# EAGLE design AZ1A_PCB_001 (EAGLE 8.7.0)
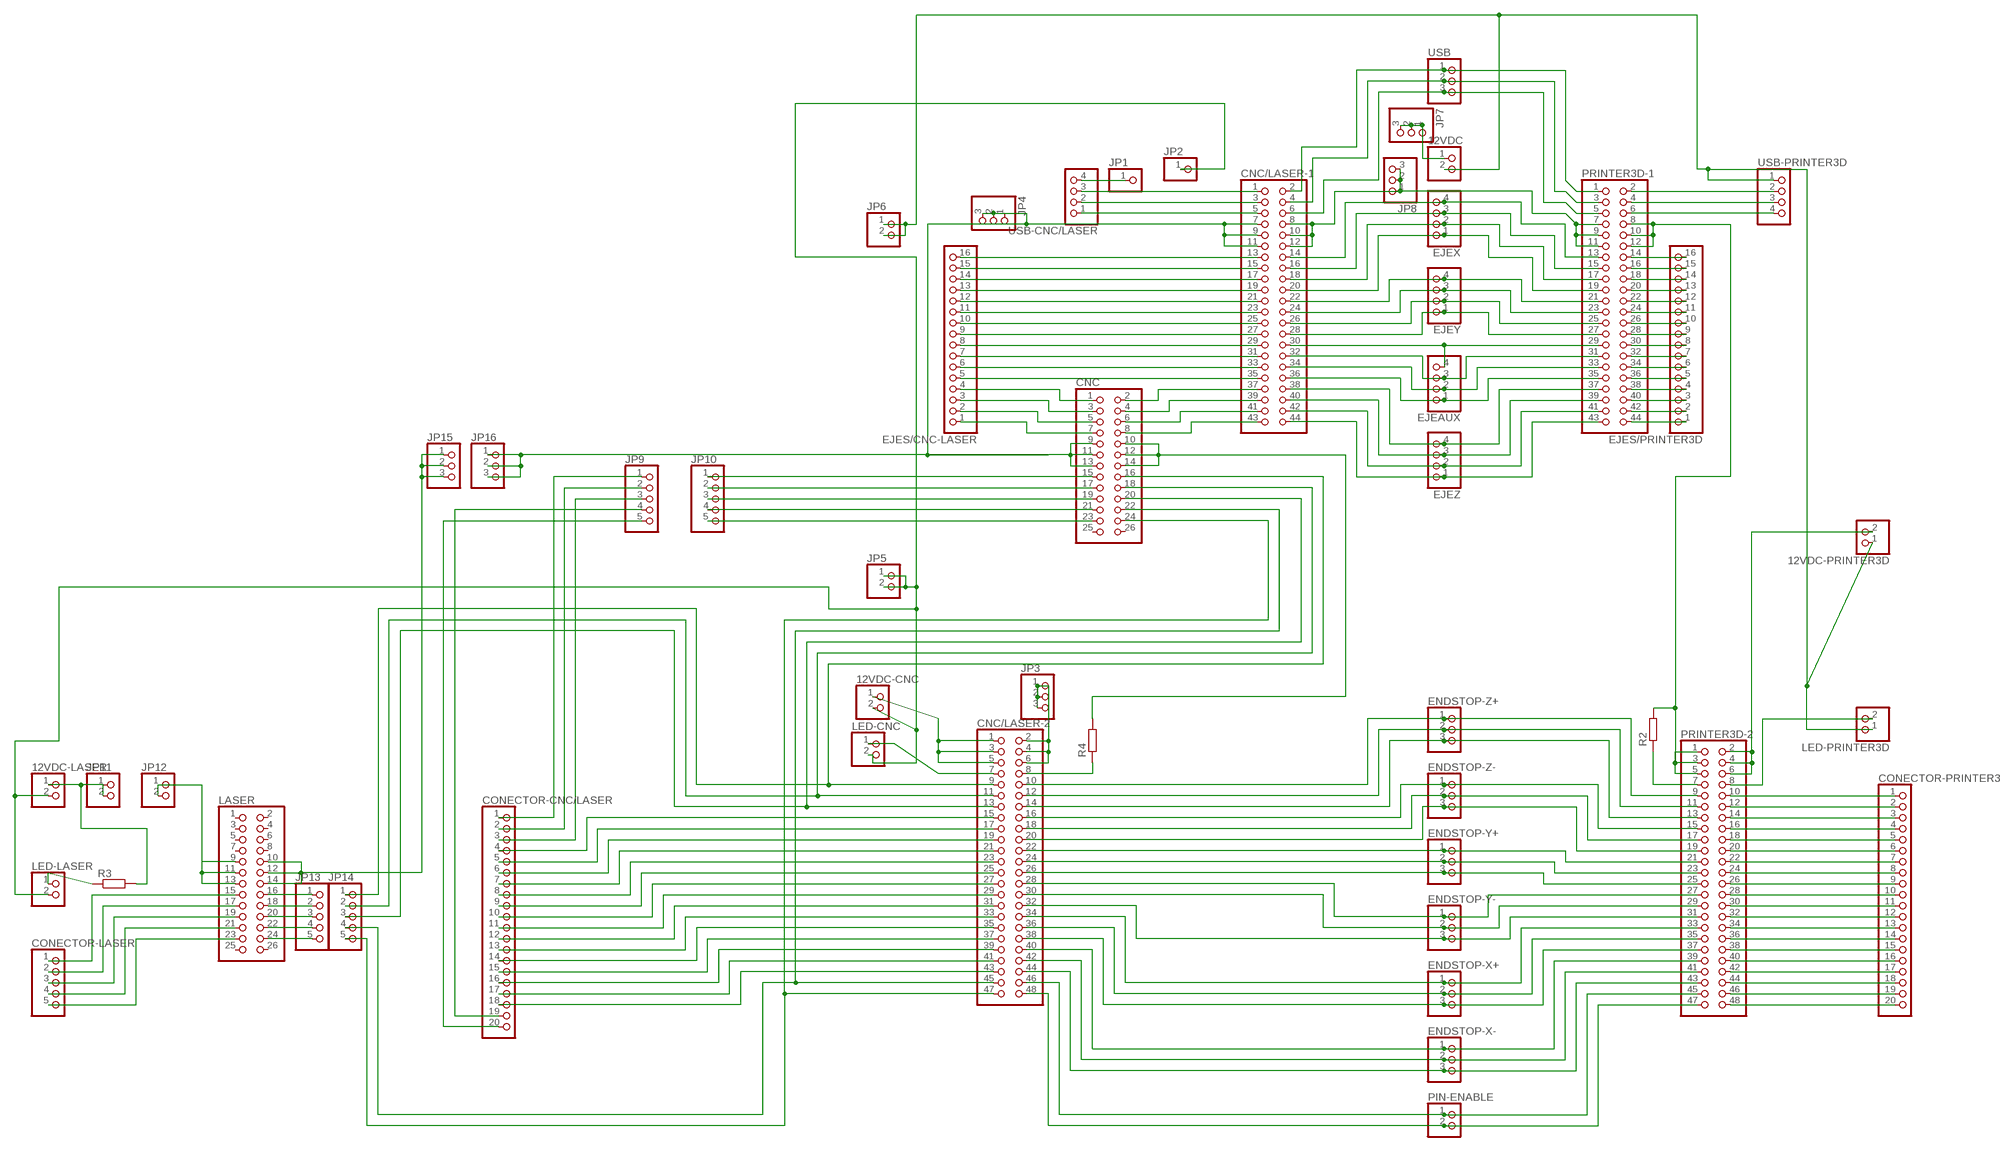
[diagram p0: schematic, sheet 1]

## Parts
12VDC  PINHD-1X2  [1X02]
12VDC-CNC  PINHD-1X2  [1X02]
12VDC-LASER  PINHD-1X2  [1X02]
12VDC-PRINTER3D  PINHD-1X2  [1X02]
CNC  PINHD-2X13  [2X13]
CNC/LASER-1  PINHD-2X22  [2X22]
CNC/LASER-2  PINHD-2X24  [2X24]
CONECTOR-CNC/LASER  PINHD-1X20  [1X20]
CONECTOR-LASER  PINHD-1X5  [1X05]
CONECTOR-PRINTER3D  PINHD-1X20  [1X20]
EJEAUX  PINHD-1X4  [1X04]
EJES/CNC-LASER  PINHD-1X16  [1X16]
EJES/PRINTER3D  PINHD-1X16  [1X16]
EJEX  PINHD-1X4  [1X04]
EJEY  PINHD-1X4  [1X04]
EJEZ  PINHD-1X4  [1X04]
ENDSTOP-X+  PINHD-1X3  [1X03]
ENDSTOP-X-  PINHD-1X3  [1X03]
ENDSTOP-Y+  PINHD-1X3  [1X03]
ENDSTOP-Y-  PINHD-1X3  [1X03]
ENDSTOP-Z+  PINHD-1X3  [1X03]
ENDSTOP-Z-  PINHD-1X3  [1X03]
JP1  PINHD-1X1  [1X01]
JP2  PINHD-1X1  [1X01]
JP3  PINHD-1X3  [1X03]
JP4  PINHD-1X3  [1X03]
JP5  PINHD-1X2  [1X02]
JP6  PINHD-1X2  [1X02]
JP7  PINHD-1X3  [1X03]
JP8  PINHD-1X3  [1X03]
JP9  PINHD-1X5  [1X05]
JP10  PINHD-1X5  [1X05]
JP11  PINHD-1X2  [1X02]
JP12  PINHD-1X2  [1X02]
JP13  PINHD-1X5  [1X05]
JP14  PINHD-1X5  [1X05]
JP15  PINHD-1X3  [1X03]
JP16  PINHD-1X3  [1X03]
LASER  PINHD-2X13  [2X13]
LED-CNC  PINHD-1X2  [1X02]
LED-LASER  PINHD-1X2  [1X02]
LED-PRINTER3D  PINHD-1X2  [1X02]
PIN-ENABLE  PINHD-1X2  [1X02]
PRINTER3D-1  PINHD-2X22  [2X22]
PRINTER3D-2  PINHD-2X24  [2X24]
R2  R-EU_0204/5  [0204/5]
R3  R-EU_0204/5  [0204/5]
R4  R-EU_0204/5  [0204/5]
USB  PINHD-1X3  [1X03]
USB-CNC/LASER  PINHD-1X4  [1X04]
USB-PRINTER3D  PINHD-1X4  [1X04]

## Nets
N$1: EJES/PRINTER3D.1 PRINTER3D-1.44
N$2: CNC/LASER-1.16 EJEX.3 PRINTER3D-1.15
N$3: CNC/LASER-1.18 EJEX.2 PRINTER3D-1.17
N$4: CNC/LASER-1.20 EJEX.1 PRINTER3D-1.19
N$5: CNC/LASER-1.22 EJEY.4 PRINTER3D-1.21
N$6: CNC/LASER-1.24 EJEY.3 PRINTER3D-1.23
N$7: CNC/LASER-1.26 EJEY.2 PRINTER3D-1.25
N$8: CNC/LASER-1.28 EJEY.1 PRINTER3D-1.27
N$9: CNC/LASER-1.30 EJEAUX.4 PRINTER3D-1.29
N$10: CNC/LASER-1.32 EJEAUX.3 PRINTER3D-1.31
N$11: CNC/LASER-1.34 EJEAUX.2 PRINTER3D-1.33
N$12: CNC/LASER-1.36 EJEAUX.1 PRINTER3D-1.35
N$13: CNC/LASER-1.38 EJEZ.4 PRINTER3D-1.37
N$14: CNC/LASER-1.40 EJEZ.3 PRINTER3D-1.39
N$15: CNC/LASER-1.42 EJEZ.2 PRINTER3D-1.41
N$16: CNC/LASER-1.44 EJEZ.1 PRINTER3D-1.43
N$17: CNC/LASER-1.8 CNC/LASER-1.10 CNC/LASER-1.12 JP8.1 JP8.2 JP8.3 PRINTER3D-1.7 PRINTER3D-1.9 PRINTER3D-1.11
N$18: CNC.10 CNC.12 CNC.14 R4.2
N$19: 12VDC-CNC.1 CNC/LASER-2.1 CNC/LASER-2.3 CNC/LASER-2.5
N$21: CNC.1 EJES/CNC-LASER.4
N$22: CNC/LASER-2.8 R4.1
N$23: CNC/LASER-2.38 ENDSTOP-X+.3 PRINTER3D-2.37
N$24: CNC.3 EJES/CNC-LASER.3
N$25: CNC/LASER-2.36 ENDSTOP-X+.2 PRINTER3D-2.35
N$26: CNC/LASER-2.34 ENDSTOP-X+.1 PRINTER3D-2.33
N$27: CNC/LASER-2.32 ENDSTOP-Y-.3 PRINTER3D-2.31
N$28: CNC/LASER-2.30 ENDSTOP-Y-.2 PRINTER3D-2.29
N$29: CNC/LASER-2.28 ENDSTOP-Y-.1 PRINTER3D-2.27
N$30: CNC/LASER-2.26 ENDSTOP-Y+.3 PRINTER3D-2.25
N$31: CNC/LASER-2.24 ENDSTOP-Y+.2 PRINTER3D-2.23
N$32: CNC/LASER-2.22 ENDSTOP-Y+.1 PRINTER3D-2.21
N$33: CNC/LASER-2.20 ENDSTOP-Z-.3 PRINTER3D-2.19
N$34: CNC/LASER-2.18 ENDSTOP-Z-.2 PRINTER3D-2.17
N$35: CNC/LASER-2.16 ENDSTOP-Z-.1 PRINTER3D-2.15
N$36: CNC/LASER-2.14 ENDSTOP-Z+.3 PRINTER3D-2.13
N$37: CNC/LASER-2.12 ENDSTOP-Z+.2 PRINTER3D-2.11
N$38: CNC/LASER-2.10 ENDSTOP-Z+.1 PRINTER3D-2.9
N$39: CNC/LASER-2.40 ENDSTOP-X-.1 PRINTER3D-2.39
N$40: CNC/LASER-2.48 PIN-ENABLE.2 PRINTER3D-2.47
N$41: CNC/LASER-2.46 PIN-ENABLE.1 PRINTER3D-2.45
N$42: CNC/LASER-2.44 ENDSTOP-X-.3 PRINTER3D-2.43
N$43: CNC/LASER-2.42 ENDSTOP-X-.2 PRINTER3D-2.41
N$44: CNC/LASER-2.7 LED-CNC.1
N$45: CNC.5 EJES/CNC-LASER.2
N$46: CNC.7 EJES/CNC-LASER.1
N$47: CNC/LASER-1.35 EJES/CNC-LASER.5
N$48: CNC/LASER-1.33 EJES/CNC-LASER.6
N$49: CNC/LASER-1.31 EJES/CNC-LASER.7
N$50: CNC/LASER-1.29 EJES/CNC-LASER.8
N$51: CNC/LASER-1.27 EJES/CNC-LASER.9
N$52: CNC/LASER-1.25 EJES/CNC-LASER.10
N$53: CNC/LASER-1.23 EJES/CNC-LASER.11
N$54: CNC/LASER-1.21 EJES/CNC-LASER.12
N$55: CNC/LASER-1.15 EJES/CNC-LASER.15
N$56: CNC/LASER-1.17 EJES/CNC-LASER.14
N$57: CNC/LASER-1.19 EJES/CNC-LASER.13
N$58: CNC/LASER-1.13 EJES/CNC-LASER.16
N$59: CNC/LASER-1.14 EJEX.4 PRINTER3D-1.13
N$60: EJES/PRINTER3D.2 PRINTER3D-1.42
N$61: EJES/PRINTER3D.3 PRINTER3D-1.40
N$62: EJES/PRINTER3D.4 PRINTER3D-1.38
N$63: EJES/PRINTER3D.5 PRINTER3D-1.36
N$64: EJES/PRINTER3D.6 PRINTER3D-1.34
N$65: EJES/PRINTER3D.7 PRINTER3D-1.32
N$66: EJES/PRINTER3D.8 PRINTER3D-1.30
N$67: EJES/PRINTER3D.9 PRINTER3D-1.28
N$68: EJES/PRINTER3D.10 PRINTER3D-1.26
N$69: EJES/PRINTER3D.11 PRINTER3D-1.24
N$70: EJES/PRINTER3D.12 PRINTER3D-1.22
N$71: EJES/PRINTER3D.13 PRINTER3D-1.20
N$72: EJES/PRINTER3D.14 PRINTER3D-1.18
N$73: EJES/PRINTER3D.15 PRINTER3D-1.16
N$74: EJES/PRINTER3D.16 PRINTER3D-1.14
N$75: 12VDC-PRINTER3D.2 PRINTER3D-2.2 PRINTER3D-2.4 PRINTER3D-2.6
N$76: PRINTER3D-1.8 PRINTER3D-1.10 PRINTER3D-1.12 PRINTER3D-2.1 PRINTER3D-2.3 PRINTER3D-2.5 R2.2
N$77: PRINTER3D-2.7 R2.1
N$78: LED-PRINTER3D.2 PRINTER3D-2.8
N$79: CNC.2 CNC/LASER-1.37
N$80: CNC.4 CNC/LASER-1.39
N$81: CNC.6 CNC/LASER-1.41
N$82: CNC.8 CNC/LASER-1.43
N$83: CNC.16 CNC/LASER-2.9 JP14.1
N$84: CNC.18 JP14.2
N$85: CNC.20 CNC/LASER-2.13 JP14.3
N$86: CNC.22 CNC/LASER-2.45 JP14.4
N$87: CNC.24 CNC/LASER-2.47 JP14.5
N$88: CONECTOR-CNC/LASER.1 JP9.1
N$89: CONECTOR-CNC/LASER.2 JP9.2
N$90: CONECTOR-CNC/LASER.3 JP9.3
N$91: CNC/LASER-2.15 CONECTOR-CNC/LASER.4
N$92: CNC/LASER-2.17 CONECTOR-CNC/LASER.5
N$93: CNC/LASER-2.19 CONECTOR-CNC/LASER.6
N$94: CNC/LASER-2.21 CONECTOR-CNC/LASER.7
N$95: CNC/LASER-2.23 CONECTOR-CNC/LASER.8
N$96: CNC/LASER-2.25 CONECTOR-CNC/LASER.9
N$97: CNC/LASER-2.27 CONECTOR-CNC/LASER.10
N$98: CNC/LASER-2.29 CONECTOR-CNC/LASER.11
N$99: CNC/LASER-2.31 CONECTOR-CNC/LASER.12
N$100: CNC/LASER-2.33 CONECTOR-CNC/LASER.13
N$101: CNC/LASER-2.35 CONECTOR-CNC/LASER.14
N$102: CNC/LASER-2.37 CONECTOR-CNC/LASER.15
N$103: CNC/LASER-2.39 CONECTOR-CNC/LASER.16
N$104: CNC/LASER-2.41 CONECTOR-CNC/LASER.17
N$105: CNC/LASER-2.43 CONECTOR-CNC/LASER.18
N$106: CONECTOR-CNC/LASER.19 JP9.4
N$107: CONECTOR-CNC/LASER.20 JP9.5
N$108: JP12.1 JP12.2 LASER.9 LASER.11 LASER.13
N$109: LED-LASER.1 R3.1
N$110: 12VDC-CNC.2 12VDC-LASER.2 JP2.1 JP5.1 JP5.2 LED-CNC.2 LED-LASER.2
N$111: CNC/LASER-1.6 PRINTER3D-1.5 USB.3
N$112: CNC/LASER-1.4 PRINTER3D-1.3 USB.2
N$113: CNC/LASER-1.2 PRINTER3D-1.1 USB.1
N$114: CNC/LASER-1.5 USB-CNC/LASER.1
N$115: CNC/LASER-1.3 USB-CNC/LASER.2
N$116: CNC/LASER-1.1 USB-CNC/LASER.3
N$117: PRINTER3D-1.6 USB-PRINTER3D.4
N$118: PRINTER3D-1.4 USB-PRINTER3D.3
N$119: PRINTER3D-1.2 USB-PRINTER3D.2
N$120: CONECTOR-LASER.1 LASER.15
N$121: CONECTOR-LASER.2 LASER.17
N$122: CNC.9 CNC.11 CNC.13 CNC/LASER-1.7 CNC/LASER-1.9 CNC/LASER-1.11 JP4.1 JP4.2 JP4.3 JP16.1 JP16.2 JP16.3
N$123: CONECTOR-LASER.3 LASER.19
N$124: CONECTOR-LASER.4 LASER.21
N$125: CONECTOR-LASER.5 LASER.23
N$126: CONECTOR-PRINTER3D.1 PRINTER3D-2.10
N$127: CONECTOR-PRINTER3D.2 PRINTER3D-2.12
N$128: CONECTOR-PRINTER3D.3 PRINTER3D-2.14
N$129: CONECTOR-PRINTER3D.4 PRINTER3D-2.16
N$130: CONECTOR-PRINTER3D.5 PRINTER3D-2.18
N$131: CONECTOR-PRINTER3D.6 PRINTER3D-2.20
N$132: CONECTOR-PRINTER3D.7 PRINTER3D-2.22
N$133: CONECTOR-PRINTER3D.8 PRINTER3D-2.24
N$134: CONECTOR-PRINTER3D.9 PRINTER3D-2.26
N$135: CONECTOR-PRINTER3D.10 PRINTER3D-2.28
N$136: CONECTOR-PRINTER3D.11 PRINTER3D-2.30
N$137: CONECTOR-PRINTER3D.12 PRINTER3D-2.32
N$138: CONECTOR-PRINTER3D.13 PRINTER3D-2.34
N$139: CONECTOR-PRINTER3D.14 PRINTER3D-2.36
N$140: CONECTOR-PRINTER3D.15 PRINTER3D-2.38
N$141: CONECTOR-PRINTER3D.16 PRINTER3D-2.40
N$142: CONECTOR-PRINTER3D.17 PRINTER3D-2.42
N$143: CONECTOR-PRINTER3D.18 PRINTER3D-2.44
N$144: CONECTOR-PRINTER3D.19 PRINTER3D-2.46
N$145: CONECTOR-PRINTER3D.20 PRINTER3D-2.48
N$148: JP1.1 USB-CNC/LASER.4
N$149: CNC/LASER-2.2 CNC/LASER-2.4 CNC/LASER-2.6 JP3.1 JP3.2 JP3.3
N$153: CNC.15 JP10.1
N$154: 12VDC-PRINTER3D.1 12VDC.2 JP6.1 JP6.2 LED-PRINTER3D.1 USB-PRINTER3D.1
N$155: 12VDC.1 JP7.1 JP7.2 JP7.3
N$156: CNC.17 JP10.2
N$157: CNC.19 JP10.3
N$158: CNC.21 JP10.4
N$159: CNC.23 JP10.5
N$160: 12VDC-LASER.1 JP11.1 JP11.2 R3.2
N$161: JP13.1 LASER.16
N$162: JP13.2 LASER.18
N$163: JP13.3 LASER.20
N$164: JP13.4 LASER.22
N$165: JP13.5 LASER.24
N$166: JP15.1 JP15.2 JP15.3 LASER.10 LASER.12 LASER.14
Unconnected: CNC.25 CNC.26 CNC/LASER-2.11 LASER.1 LASER.2 LASER.3 LASER.4 LASER.5 LASER.6 LASER.7 LASER.8 LASER.25 LASER.26

## Library data of the parts
12VDC 12VDC-CNC 12VDC-LASER 12VDC-PRINTER3D JP5 JP6 JP11 JP12 LED-CNC LED-LASER LED-PRINTER3D PIN-ENABLE = pinhead:PINHD-1X2: PIN HEADER
CNC LASER = pinhead:PINHD-2X13: PIN HEADER
CNC/LASER-1 PRINTER3D-1 = pinhead:PINHD-2X22: PIN HEADER
CNC/LASER-2 PRINTER3D-2 = pinhead:PINHD-2X24: PIN HEADER
CONECTOR-CNC/LASER CONECTOR-PRINTER3D = pinhead:PINHD-1X20: PIN HEADER
CONECTOR-LASER JP9 JP10 JP13 JP14 = pinhead:PINHD-1X5: PIN HEADER
EJEAUX EJEX EJEY EJEZ USB-CNC/LASER USB-PRINTER3D = pinhead:PINHD-1X4: PIN HEADER
EJES/CNC-LASER EJES/PRINTER3D = pinhead:PINHD-1X16: PIN HEADER
ENDSTOP-X+ ENDSTOP-X- ENDSTOP-Y+ ENDSTOP-Y- ENDSTOP-Z+ ENDSTOP-Z- JP3 JP4 JP7 JP8 JP15 JP16 USB = pinhead:PINHD-1X3: PIN HEADER
JP1 JP2 = pinhead:PINHD-1X1: PIN HEADER
R2 = resistor:R-EU_: RESISTOR, European symbol
R3 R4 = rcl:R-EU_: RESISTOR, European symbol; SPICEPREFIX: R

## Board
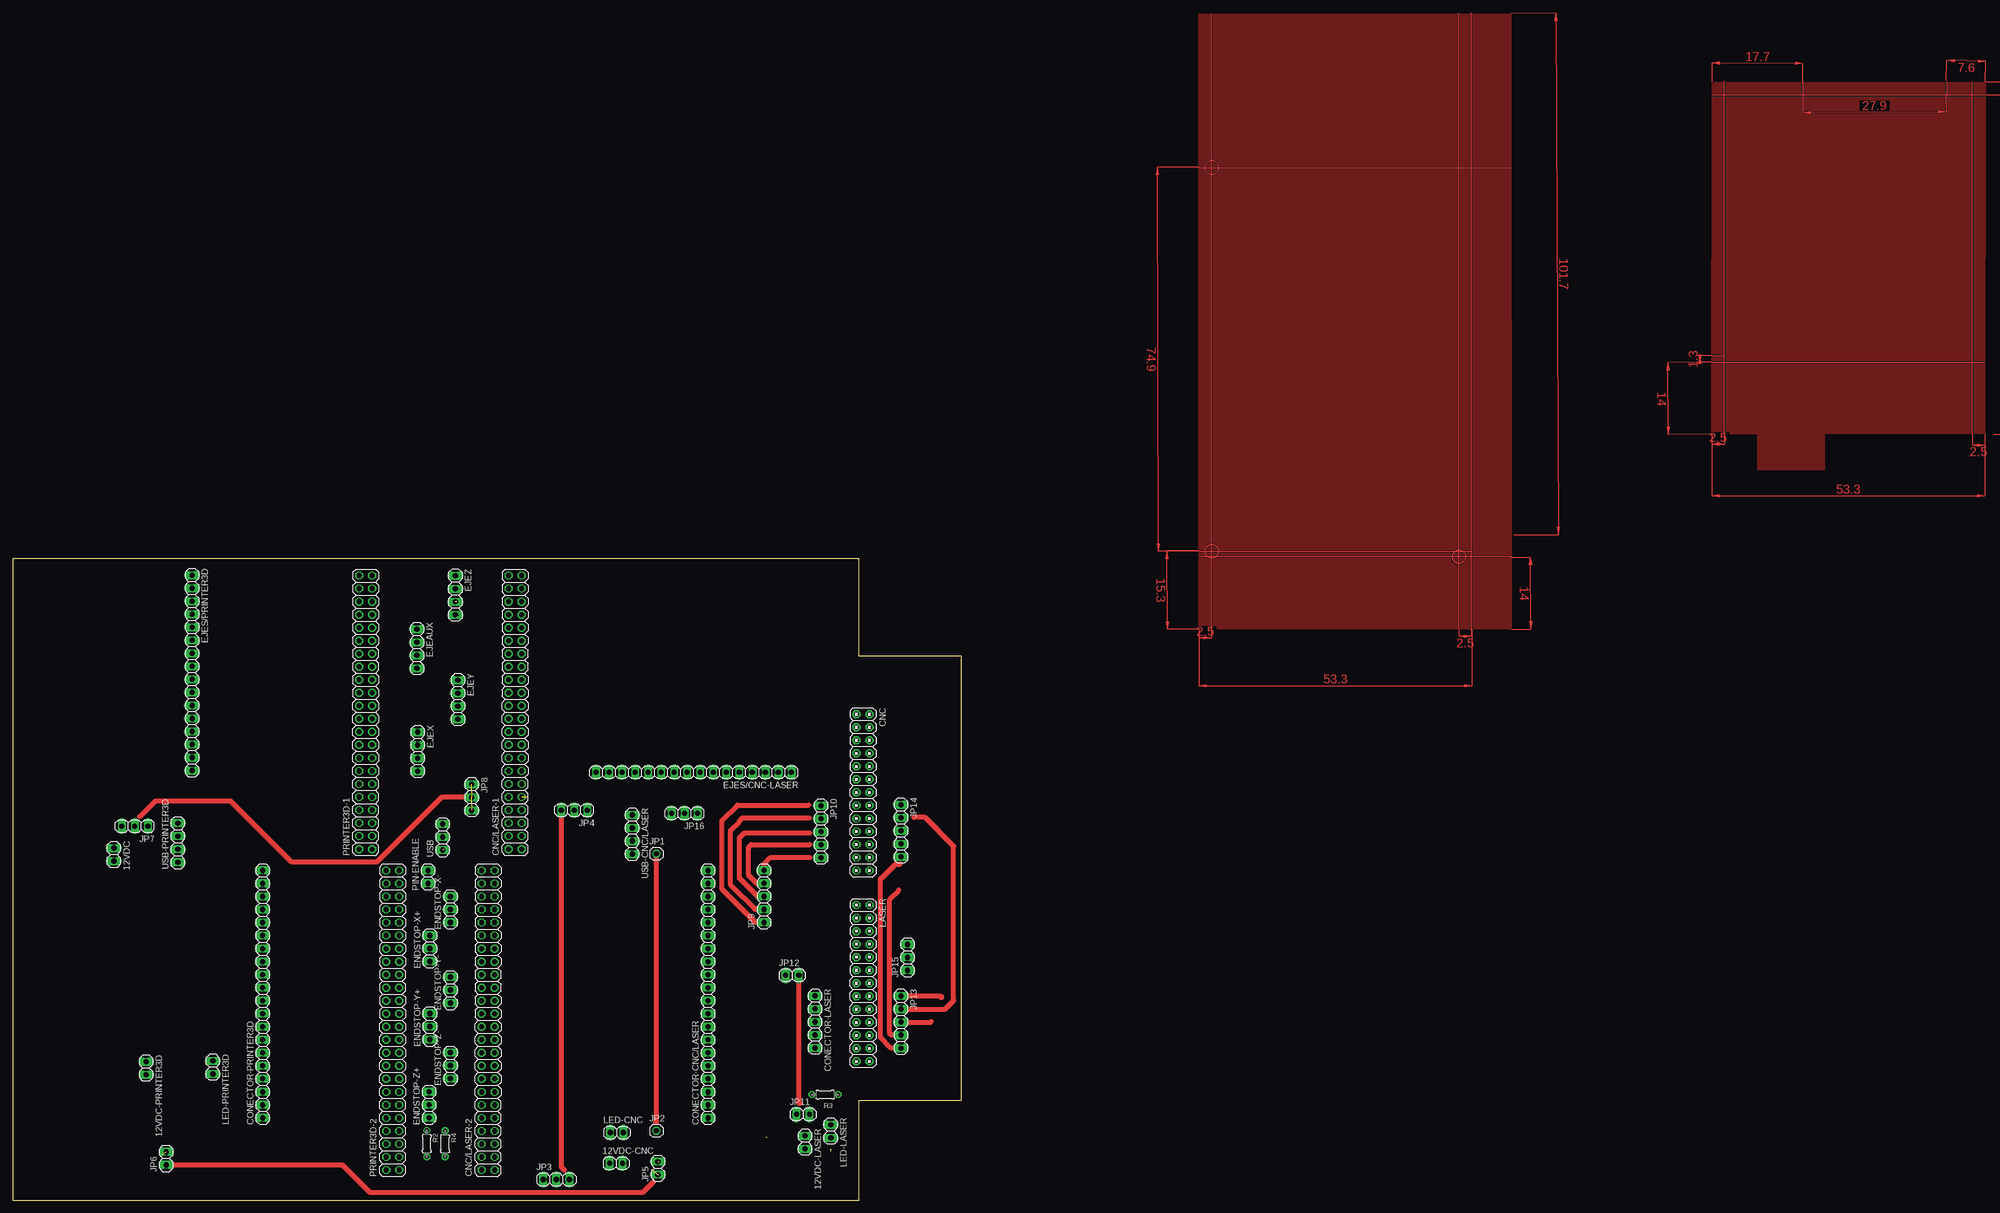
[diagram p1: board, top side]
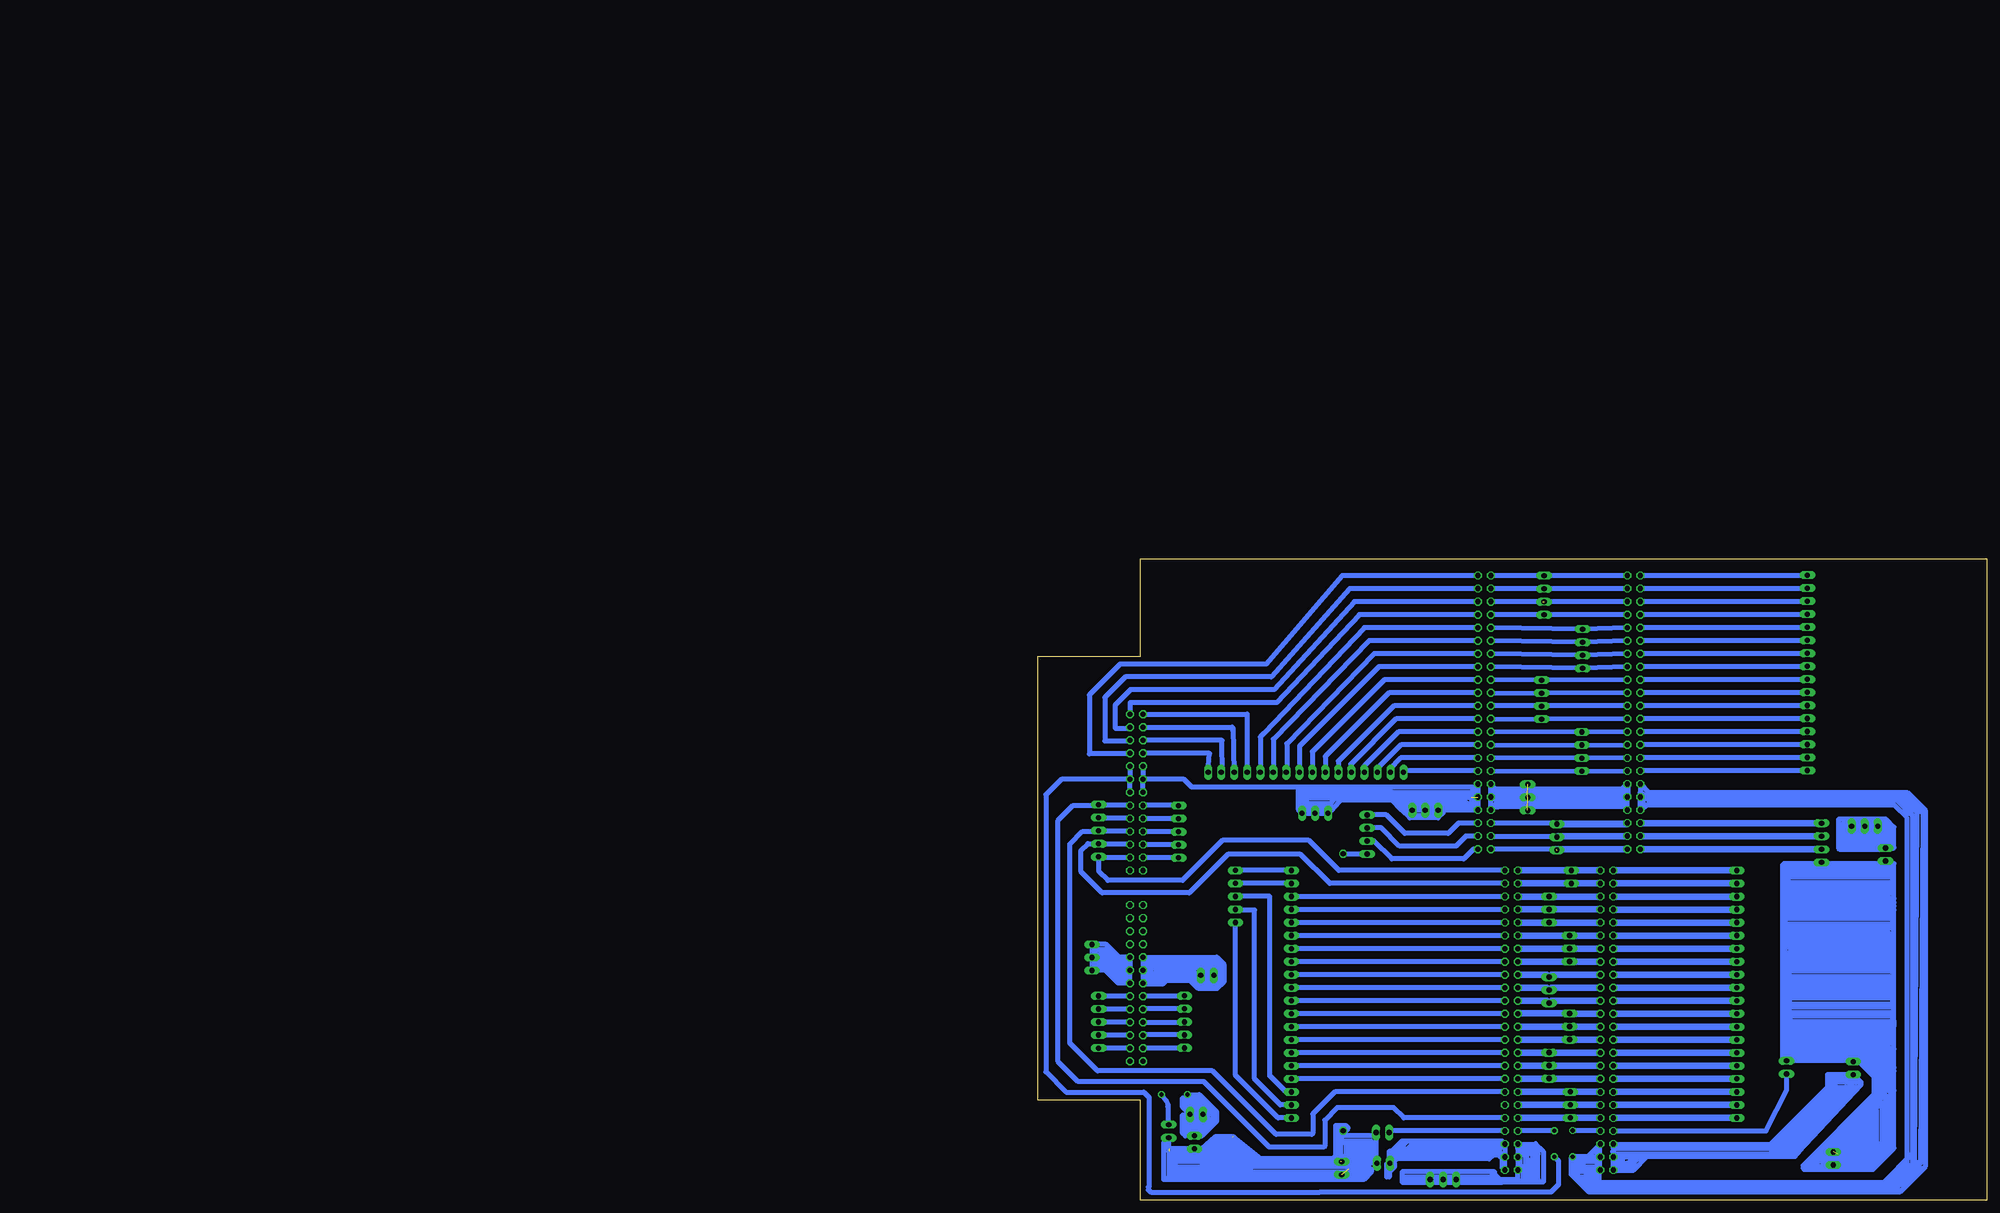
[diagram p2: board, bottom side, seen from below]

Size 185 x 125 mm. Coordinates in mm from the lower left corner, seen from the top.
Outline: 0,0 165,0 165,19.5 185,19.5 185,106 165,106 165,125 0,125 0,0
Copper layers (1*16): Top 0.035mm / dielectric 1.5mm / Bottom 0.035mm
Design rules "default": minimum track width 6mil, minimum drill 0.35mm, track to track 6mil, track to pad 6mil, pad to pad 6mil, via to via 6mil, smd to smd 6mil, copper to edge 40mil, drill to drill 6mil, minimum pad ring 10mil, minimum via ring 8mil, stop-mask expansion 4mil, vias tented up to drill 0mil, thermal gap 10mil

### Footprints (pad centres in the part's own frame; a part is rotated, then mirrored left to right if it is on the bottom)
1X02 = drill 1.016 long: 1 -1.27,0; 2 1.27,0
2X13 = drill 1.016 octagon: 1 -15.24,-1.27; 2 -15.24,1.27; 3 -12.7,-1.27; 4 -12.7,1.27; 5 -10.16,-1.27; 6 -10.16,1.27; 7 -7.62,-1.27; 8 -7.62,1.27; 9 -5.08,-1.27; 10 -5.08,1.27; 11 -2.54,-1.27; 12 -2.54,1.27; 13 0,-1.27; 14 0,1.27; 15 2.54,-1.27; 16 2.54,1.27; 17 5.08,-1.27; 18 5.08,1.27; 19 7.62,-1.27; 20 7.62,1.27; 21 10.16,-1.27; 22 10.16,1.27; 23 12.7,-1.27; 24 12.7,1.27; 25 15.24,-1.27; 26 15.24,1.27
2X22 = drill 1.016 octagon: 1 -25.4,-1.27; 2 -25.4,1.27; 3 -22.86,-1.27; 4 -22.86,1.27; 5 -20.32,-1.27; 6 -20.32,1.27; 7 -17.78,-1.27; 8 -17.78,1.27; 9 -15.24,-1.27; 10 -15.24,1.27; 11 -12.7,-1.27; 12 -12.7,1.27; 13 -10.16,-1.27; 14 -10.16,1.27; 15 -7.62,-1.27; 16 -7.62,1.27; 17 -5.08,-1.27; 18 -5.08,1.27; 19 -2.54,-1.27; 20 -2.54,1.27; 21 0,-1.27; 22 0,1.27; 23 2.54,-1.27; 24 2.54,1.27; 25 5.08,-1.27; 26 5.08,1.27; 27 7.62,-1.27; 28 7.62,1.27; 29 10.16,-1.27; 30 10.16,1.27; 31 12.7,-1.27; 32 12.7,1.27; 33 15.24,-1.27; 34 15.24,1.27; 35 17.78,-1.27; 36 17.78,1.27; 37 20.32,-1.27; 38 20.32,1.27; 39 22.86,-1.27; 40 22.86,1.27; 41 25.4,-1.27; 42 25.4,1.27; 43 27.94,-1.27; 44 27.94,1.27
2X24 = drill 1.016 octagon: 1 -27.94,-1.27; 2 -27.94,1.27; 3 -25.4,-1.27; 4 -25.4,1.27; 5 -22.86,-1.27; 6 -22.86,1.27; 7 -20.32,-1.27; 8 -20.32,1.27; 9 -17.78,-1.27; 10 -17.78,1.27; 11 -15.24,-1.27; 12 -15.24,1.27; 13 -12.7,-1.27; 14 -12.7,1.27; 15 -10.16,-1.27; 16 -10.16,1.27; 17 -7.62,-1.27; 18 -7.62,1.27; 19 -5.08,-1.27; 20 -5.08,1.27; 21 -2.54,-1.27; 22 -2.54,1.27; 23 0,-1.27; 24 0,1.27; 25 2.54,-1.27; 26 2.54,1.27; 27 5.08,-1.27; 28 5.08,1.27; 29 7.62,-1.27; 30 7.62,1.27; 31 10.16,-1.27; 32 10.16,1.27; 33 12.7,-1.27; 34 12.7,1.27; 35 15.24,-1.27; 36 15.24,1.27; 37 17.78,-1.27; 38 17.78,1.27; 39 20.32,-1.27; 40 20.32,1.27; 41 22.86,-1.27; 42 22.86,1.27; 43 25.4,-1.27; 44 25.4,1.27; 45 27.94,-1.27; 46 27.94,1.27; 47 30.48,-1.27; 48 30.48,1.27
1X20 = drill 1.016 long: 1 -24.13,0; 2 -21.59,0; 3 -19.05,0; 4 -16.51,0; 5 -13.97,0; 6 -11.43,0; 7 -8.89,0; 8 -6.35,0; 9 -3.81,0; 10 -1.27,0; 11 1.27,0; 12 3.81,0; 13 6.35,0; 14 8.89,0; 15 11.43,0; 16 13.97,0; 17 16.51,0; 18 19.05,0; 19 21.59,0; 20 24.13,0
1X05 = drill 1.016 long: 1 -5.08,0; 2 -2.54,0; 3 0,0; 4 2.54,0; 5 5.08,0
1X04 = drill 1.016 long: 1 -3.81,0; 2 -1.27,0; 3 1.27,0; 4 3.81,0
1X16 = drill 1.016 long: 1 -19.05,0; 2 -16.51,0; 3 -13.97,0; 4 -11.43,0; 5 -8.89,0; 6 -6.35,0; 7 -3.81,0; 8 -1.27,0; 9 1.27,0; 10 3.81,0; 11 6.35,0; 12 8.89,0; 13 11.43,0; 14 13.97,0; 15 16.51,0; 16 19.05,0
1X03 = drill 1.016 long: 1 -2.54,0; 2 0,0; 3 2.54,0
1X01 = drill 1.016 octagon: 1 0,0
0204/5 = drill 0.813 octagon: 1 -2.54,0; 2 2.54,0

### Placement (x,y rotation side)
12VDC  19.71,67.36 270 top
12VDC-CNC  117.65,7.16 0 top
12VDC-LASER  154.51,11.26 270 top
12VDC-PRINTER3D  26.01,25.71 270 top
CNC  165.79,79.48 270 top
CNC/LASER-1  97.95,93.82 90 top
CNC/LASER-2  92.69,33.78 90 top
CONECTOR-CNC/LASER  135.59,40.13 90 top
CONECTOR-LASER  156.46,34.73 270 top
CONECTOR-PRINTER3D  48.74,40.13 90 top
EJEAUX  78.81,107.48 270 top
EJES/CNC-LASER  132.79,83.39 180 top
EJES/PRINTER3D  34.96,102.79 270 top
EJEX  78.96,87.43 270 top
EJEY  86.81,97.55 270 top
EJEZ  86.31,117.91 270 top
ENDSTOP-X+  81.34,49.05 90 top
ENDSTOP-X-  85.34,56.66 90 top
ENDSTOP-Y+  81.34,33.83 90 top
ENDSTOP-Y-  85.34,40.94 90 top
ENDSTOP-Z+  81.19,18.57 90 top
ENDSTOP-Z-  85.34,26.22 90 top
JP1  125.5,67.5 0 top
JP2  125.5,13.5 0 top
JP3  106,4 0 top
JP4  109.5,76 180 top
JP5  125.8,6.2 90 top
JP6  29.9,8.1 90 top
JP7  23.8,72.9 180 top
JP8  89.5,78.5 270 top
JP9  146.5,59.2 90 top
JP10  157.6,71.8 270 top
JP11  154.1,16.7 0 top
JP12  152,43.8 0 top
JP13  173.2,34.7 270 top
JP14  173.2,72 270 top
JP15  174.5,47.3 90 top
JP16  131,75.4 180 top
LASER  165.79,42.27 270 top
LED-CNC  117.8,13.16 0 top
LED-LASER  159.51,13.41 270 top
LED-PRINTER3D  39.01,25.86 270 top
PIN-ENABLE  80.99,62.99 90 top
PRINTER3D-1  68.83,93.82 90 top
PRINTER3D-2  74.07,33.78 90 top
R2  80.74,11 270 top
R3  158.42,20.56 180 top
R4  84.3,10.97 270 top
USB  83.84,70.77 90 top
USB-CNC/LASER  120.81,71.27 270 top
USB-PRINTER3D  32.19,69.66 90 top

### Tracks (layer width: path | path; a pad name or v marks a point on that pad's centre or on a via)
N$1
  Bottom 1.016: EJES/PRINTER3D.1 arc90 35.04,121.76 PRINTER3D-1.44
N$2
  Bottom 1.016: PRINTER3D-1.15 EJEX.3 CNC/LASER-1.16
N$3
  Bottom 1.016: PRINTER3D-1.17 EJEX.2 CNC/LASER-1.18
N$4
  Bottom 1.016: PRINTER3D-1.19 EJEX.1 CNC/LASER-1.20
N$5
  Bottom 1.016: PRINTER3D-1.21 EJEY.4 CNC/LASER-1.22
N$6
  Bottom 1.016: PRINTER3D-1.23 CNC/LASER-1.24 EJEY.3
N$7
  Bottom 1.016: PRINTER3D-1.25 EJEY.2 CNC/LASER-1.26
N$8
  Bottom 1.016: PRINTER3D-1.27 EJEY.1 CNC/LASER-1.28
N$9
  Bottom 1.016: PRINTER3D-1.29 EJEAUX.4 CNC/LASER-1.30
N$10
  Bottom 1.016: PRINTER3D-1.31 EJEAUX.3 CNC/LASER-1.32
N$11
  Bottom 1.016: PRINTER3D-1.33 EJEAUX.2 CNC/LASER-1.34
N$12
  Bottom 1.016: PRINTER3D-1.35 EJEAUX.1 CNC/LASER-1.36
N$13
  Bottom 1.016: PRINTER3D-1.37 86.27,114.14 EJEZ.4 CNC/LASER-1.38
N$14  (1 unrouted)
  Bottom 1.016: PRINTER3D-1.39 86.68,116.68 | EJEZ.3 CNC/LASER-1.40
N$15
  Bottom 1.016: PRINTER3D-1.41 70.14,119.18 EJEZ.2 CNC/LASER-1.42
N$16
  Bottom 1.016: PRINTER3D-1.43 EJEZ.1 CNC/LASER-1.44
N$17  (2 unrouted)
  Top 1.016: JP8.2 83.6,78.5 71,65.9 54.4,65.9 42.5,77.8 27.8,77.8 24.74,74.74
  Bottom 1.016: 89.42,81.12 JP8.1 | CNC/LASER-1.10 89.58,78.58 | 89.58,78.58 JP8.2 | PRINTER3D-1.9 70.5,78.58 | 70.5,78.58 89.58,78.58 | CNC/LASER-1.8 96.68,78.1 | 96.68,78.1 CNC/LASER-1.10 | CNC/LASER-1.10 CNC/LASER-1.12 | 89.58,76.04 JP8.3 | 70.18,75.96 PRINTER3D-1.7 PRINTER3D-1.9 | PRINTER3D-1.11 71.12,80.1 95.8,80.1 96.1,80.4 96.1,79.5 71.2,79.5 70.5,78.8 70.5,78.58 | PRINTER3D-1.9 70.58,78.1 96.68,78.1 | CNC/LASER-1.8 95.8,76.92 95.8,77.3 70.9,77.3 71,77.2 71,76.7 95.2,76.7 95.3,76.6 96.12,76.6 CNC/LASER-1.8
  Bottom 1.27: PRINTER3D-1.11 PRINTER3D-1.9
N$18
  Bottom 1.016: CNC.10 CNC.12 | CNC.12 CNC.14 167.15,79.57 | CNC.12 180.48,82.02 183.48,79.02 183.48,24.98 179.52,21.02 164.37,21.02 163.34,20 163.34,2.65 163.48,2.52 163.48,2 163,1.52 130,1.52 129.5,1.52 84.98,1.52 83.5,3 83.5,7.63 R4.2
N$19
  Bottom 1.016: CNC/LASER-2.3 CNC/LASER-2.1 94.5,6.38 94.5,8 95.25,8.75 96.25,8.75 | CNC/LASER-2.5 CNC/LASER-2.3 | CNC/LASER-2.5 95,9.88 95,8.5 | 115.5,7.5 115.5,8.5 114,10 95.5,10 95.5,9.5 96.25,8.75 | CNC/LASER-2.5 112.08,10.92 114.5,8.5 97.5,8.5 96.5,9.5 113.5,9.5 115,8 97,8 96.25,8.75 | CNC/LASER-2.5 94.54,11.5 113,11.5 | 113,11.5 114,11.5 116,9.5 116.5,9.5 116.5,7.28 116.72,7.28 117,7 117,4.5 116.5,4.5 116.5,5.5 115.5,6.5 115.5,7 116.22,7 12VDC-CNC.1 | 113,11.5 115.5,9 | 115.5,9 116,9 | 115.5,9 94.58,9 CNC/LASER-2.3
N$20
  Top 0.152: 331.4,163.3 384.6,163.3
N$21
  Bottom 1.016: CNC.1 144.22,94.72 EJES/CNC-LASER.4
N$22
  Bottom 1.016: R4.1 91.37,13.51 CNC/LASER-2.8
N$23
  Bottom 1.27: PRINTER3D-2.37 81.31,51.56 | 81.31,51.56 ENDSTOP-X+.3 | CNC/LASER-2.38 81.31,51.56
N$24
  Bottom 1.016: CNC.3 147.18,92.18 147,91.5 147,92.13 EJES/CNC-LASER.3
N$25
  Bottom 1.27: PRINTER3D-2.35 81.31,49.02 | 81.31,49.02 ENDSTOP-X+.2 | CNC/LASER-2.36 81.31,49.02
N$26
  Bottom 1.27: PRINTER3D-2.33 81.31,46.48 | 81.31,46.48 ENDSTOP-X+.1 | CNC/LASER-2.34 81.31,46.48
N$27
  Bottom 1.27: PRINTER3D-2.31 84.88,43.94 ENDSTOP-Y-.3 85.8,43.94 CNC/LASER-2.32
N$28
  Bottom 1.27: PRINTER3D-2.29 84.88,41.4 ENDSTOP-Y-.2 85.8,41.4 CNC/LASER-2.30
N$29
  Bottom 1.27: PRINTER3D-2.27 84.88,38.86 ENDSTOP-Y-.1 85.8,38.86 CNC/LASER-2.28
N$30
  Bottom 1.27: PRINTER3D-2.25 81.29,36.32 ENDSTOP-Y+.3 91.37,36.37 CNC/LASER-2.26
N$31
  Bottom 1.27: CNC/LASER-2.24 81.39,33.78 ENDSTOP-Y+.2 75.39,33.83 PRINTER3D-2.23
N$32
  Bottom 1.27: PRINTER3D-2.21 81.29,31.24 ENDSTOP-Y+.1 91.37,31.29 CNC/LASER-2.22
N$33
  Bottom 1.27: CNC/LASER-2.20 85.4,28.7 | 85.4,28.7 ENDSTOP-Z-.3 | PRINTER3D-2.19 85.4,28.7
N$34
  Bottom 1.27: PRINTER3D-2.17 75.4,26.22 ENDSTOP-Z-.2 85.4,26.16 CNC/LASER-2.18
N$35
  Bottom 1.27: PRINTER3D-2.15 75.4,23.68 ENDSTOP-Z-.1 91.36,23.68 CNC/LASER-2.16
N$36
  Bottom 1.27: PRINTER3D-2.13 81.16,21.08 | 81.16,21.08 ENDSTOP-Z+.3 | CNC/LASER-2.14 81.16,21.08
N$37
  Bottom 1.27: PRINTER3D-2.11 81.16,18.54 | 81.16,18.54 ENDSTOP-Z+.2 | CNC/LASER-2.12 81.16,18.54
N$38
  Bottom 1.27: PRINTER3D-2.9 81.16,16 | 81.16,16 ENDSTOP-Z+.1 | CNC/LASER-2.10 81.16,16
N$39
  Bottom 1.27: PRINTER3D-2.39 85.34,54.1 | 85.34,54.1 ENDSTOP-X-.1 | CNC/LASER-2.40 85.34,54.1
N$40
  Bottom 1.27: PRINTER3D-2.47 PIN-ENABLE.2 CNC/LASER-2.48
N$41
  Bottom 1.27: PRINTER3D-2.45 PIN-ENABLE.1 CNC/LASER-2.46
N$42
  Bottom 1.27: PRINTER3D-2.43 85.34,59.18 | 85.34,59.18 ENDSTOP-X-.3 | CNC/LASER-2.44 85.34,59.18
N$43
  Bottom 1.27: CNC/LASER-2.42 91.42,56.66 ENDSTOP-X-.2 75.34,56.66 PRINTER3D-2.41
N$44
  Bottom 1.016: CNC/LASER-2.7 116.23,13.46 LED-CNC.1
N$45
  Bottom 1.016: EJES/CNC-LASER.2 149.5,83.09 149,83 149.14,89.64 CNC.5
N$46
  Bottom 1.016: EJES/CNC-LASER.1 151.55,87.1 CNC.7
N$47
  Bottom 1.016: CNC/LASER-1.35 121.4,111.6 141,91 141.68,90.32 EJES/CNC-LASER.5 141.5,83.57
N$48
  Bottom 1.016: CNC/LASER-1.33 120.44,109.06 139.14,89.86 EJES/CNC-LASER.6 139,83.53
N$49
  Bottom 1.016: CNC/LASER-1.31 119.48,106.52 136.5,89 136.5,83.49 EJES/CNC-LASER.7
N$50
  Bottom 1.016: CNC/LASER-1.29 118.52,103.98 134,88.5 134,83.45 EJES/CNC-LASER.8
N$51
  Bottom 1.016: CNC/LASER-1.27 117.5,101.44 | 117.5,101.44 117.56,101.44 | EJES/CNC-LASER.9 131.5,83.41 131.5,87.44 117.5,101.44
N$52
  Bottom 1.016: CNC/LASER-1.25 116.6,98.9 129,86.5 129,83.41 EJES/CNC-LASER.10
N$53
  Bottom 1.016: CNC/LASER-1.23 115.64,96.36 126.44,85.56 EJES/CNC-LASER.11
N$54
  Bottom 1.016: CNC/LASER-1.21 115.18,93.82 124,85 124,83.49 EJES/CNC-LASER.12
N$55
  Bottom 1.016: CNC/LASER-1.15 114.3,86.2 116.5,84 116.28,83.78 EJES/CNC-LASER.15
N$56
  Bottom 1.016: CNC/LASER-1.17 114.26,88.74 119,84 118.82,83.82 EJES/CNC-LASER.14
N$57
  Bottom 1.016: CNC/LASER-1.19 114.72,91.28 121.36,84.64 EJES/CNC-LASER.13
N$58
  Bottom 1.016: EJES/CNC-LASER.16 113.47,83.66 CNC/LASER-1.13
N$59
  Bottom 1.016: PRINTER3D-1.13 EJEX.4 CNC/LASER-1.14
N$60
  Bottom 1.016: EJES/PRINTER3D.2 arc90 35.04,119.22 PRINTER3D-1.42
N$61
  Bottom 1.016: EJES/PRINTER3D.3 arc90 35.04,116.68 PRINTER3D-1.40
N$62
  Bottom 1.016: EJES/PRINTER3D.4 arc90 35.04,114.14 PRINTER3D-1.38
N$63
  Bottom 1.016: EJES/PRINTER3D.5 arc90 35.04,111.6 PRINTER3D-1.36
N$64
  Bottom 1.016: EJES/PRINTER3D.6 arc90 35.04,109.06 PRINTER3D-1.34
N$65
  Bottom 1.016: EJES/PRINTER3D.7 arc90 35.04,106.52 PRINTER3D-1.32
N$66
  Bottom 1.016: EJES/PRINTER3D.8 arc90 35.04,103.98 PRINTER3D-1.30
N$67
  Bottom 1.016: EJES/PRINTER3D.9 arc90 35.04,101.44 PRINTER3D-1.28
N$68
  Bottom 1.016: EJES/PRINTER3D.10 arc90 35.04,98.9 PRINTER3D-1.26
N$69
  Bottom 1.016: EJES/PRINTER3D.11 arc90 35.04,96.36 PRINTER3D-1.24
N$70
  Bottom 1.016: EJES/PRINTER3D.12 arc90 35.04,93.82 PRINTER3D-1.22
N$71
  Bottom 1.016: EJES/PRINTER3D.13 arc90 35.04,91.28 PRINTER3D-1.20
N$72
  Bottom 1.016: EJES/PRINTER3D.14 arc90 35.04,88.74 PRINTER3D-1.18
N$73
  Bottom 1.016: EJES/PRINTER3D.15 arc90 35.04,86.2 PRINTER3D-1.16
N$74
  Bottom 1.016: EJES/PRINTER3D.16 arc90 35.04,83.66 PRINTER3D-1.14
N$75
  Bottom 1.016: PRINTER3D-2.2 PRINTER3D-2.4 | 12VDC-PRINTER3D.2 26.07,24.5 31,24.5 31,22 42.08,10.92 PRINTER3D-2.6 72.8,10 42.5,10 30.5,22 30.5,24 30,23.5 29.5,24 | 12VDC-PRINTER3D.2 25.95,24.5 | PRINTER3D-2.4 72.42,8 | 73,9.5 72.8,9.3 | 72.8,9.3 PRINTER3D-2.4 | 72.8,9.3 72,8.5 72,9 68.1,9 | 38.5,9 63.3,9 68.1,9 | 38.5,9 37.3,9 | 37.3,9 37,9 36.7,9.3 24.5,22.5 24.5,23 | 24.5,23 29.5,23 30,22.5 29.5,22 | 29.5,22 29.3,22 | 27.5,22 25.5,22 37.4,10.1 | 37.65,9.85 38,9.5 | 38,9.5 42,9.5 30,21.5 30,22 29.5,22 | 29.3,22 27.5,22 | 27.5,22 27,21.5 38.5,10 40.5,10 35,15.5 34.5,15.5 | 28,21 28.5,21.5 34.5,15.5 | 28,21 37.5,11.5 | 37.5,11.5 38.5,10.5 39,10.5 38,11.5 | 37.5,11.5 37.7,11.5 | 37.7,11.5 38,11.5 | 28,21 26.01,22.99 26.01,23.5 | 26.01,23.5 12VDC-PRINTER3D.2 | 38.5,9 38,9.5 | 37.65,9.85 37.4,10.1 | 12VDC-PRINTER3D.2 29.06,24.44 29.5,24 | 29.5,24 29.2,23.7 26.21,23.7 26.01,23.5 | 29.3,22 38,13.3 38,11.5 | 37.7,11.5 34.5,14.7 34.5,15.5 | 37.65,9.85 37.65,9.35 37.3,9 | 12VDC-PRINTER3D.2 24.5,23 | PRINTER3D-2.2 68.86,5.84 66.2,8.5 37.4,8.5 37.4,10.1 | PRINTER3D-2.2 71.5,7.14 71.5,8.2 | 71.5,8.3 71.5,8.2 | 71.5,8.2 72.3,7.4 71.4,6.5 69.5,6.5 67.7,8.3 | 67.7,8.3 67.2,8.3 | 67.7,8.3 70.7,8.3 70.9,8.5 71.1,8.3 71.1,7.2 70.1,7.2 70,7.1 68.1,9
N$76
  Bottom 0.508: 75,5.5 PRINTER3D-2.1
  Bottom 1.016: PRINTER3D-2.1 75.68,5.5 79.5,5.5 80.74,6.74 R2.2 | R2.2 80.66,8.38 PRINTER3D-2.3 75.38,8.38 76,9 76,8 76.5,7.5 80,7.5 80,7 79,6 78.5,6 78.5,6.5 | R2.2 77.8,8.46 PRINTER3D-2.5 75.5,10.76 75.5,6 PRINTER3D-2.1 | 78.5,6.5 79,7 | 78.5,6.5 76,6.5 | 76,7 76,6.5 | 76,6.5 PRINTER3D-2.1 | 67.56,79.5 PRINTER3D-1.12 65.94,79.5 15.5,79.5 | 67.56,79.5 PRINTER3D-1.10 PRINTER3D-1.8 65,78 | 15.5,79.5 14.75,78.75 | 14.75,78.75 12,76 12,6.5 | 12,6.5 16.98,1.52 | R2.2 81,8.2 81,5 77.52,1.52 16.98,1.52 | 75.5,3.5 20,3.5 14.5,9 | 75.5,3.5 75.5,5.68 PRINTER3D-2.1 | PRINTER3D-2.1 80.5,5.5 77,2 79,4.5 76.5,5 76,4 77.5,4 78,4.5 76.5,2.5 76,2.5 | 76,2.5 20,2.5 15.5,7 15.5,74.5 18,77 67,77 67,79 66,78 65,78 | 65,78 17.5,78 14.5,75 14.5,9 | 14.5,9 14.5,7 18,3.5 | 18,3.5 19.5,2 17.5,2.5 | 17.5,2.5 17,3 | 17,3 13,7 | 13,7 13.8,7.4 | 13.8,7.4 14,7.5 13.5,75.5 17,78.5 | 17,78.5 66,78.5 67.56,79.5 | 17,78.5 15.5,79.5 | 14.75,78.75 16,78.5 12.5,75.5 13,7 | 12,6.5 17.5,2.5 | 18,3.5 16.98,1.52 | 17,3 13.8,7.4 | 76,2.5 76.5,3.5 75.5,3.5
N$77
  Bottom 1.016: PRINTER3D-2.7 80.66,13.46 R2.1
N$78
  Bottom 1.016: PRINTER3D-2.8 43.04,13.46 39,21.5 39.01,21.51 LED-PRINTER3D.2
N$79
  Bottom 1.016: CNC/LASER-1.37 122.36,114.14 138.5,97 167,97 167.06,96.94 CNC.2
N$80
  Bottom 1.016: CNC/LASER-1.39 123.32,116.68 139,99.5 167,99.5 170,96.5 170,92 167.24,92 CNC.4
N$81
  Bottom 1.016: CNC/LASER-1.41 124.28,119.22 139.5,102 168,102 172,98 172,89.5 167.2,89.5 CNC.6
N$82
  Bottom 1.016: CNC/LASER-1.43 125.74,121.76 140.52,104.48 169.02,104.48 175,98.5 175,87 174.9,87.1 CNC.8
N$83
  Bottom 1.016: CNC/LASER-2.9 113.7,16 115.7,18 126.7,18 129.1,15.6 129.1,10.5 129.3,10.3 139.9,10.3 152.7,23.1 177.2,23.1 181.1,27 181.1,74 178.16,76.94 173.06,76.94 | CNC.16 173.06,76.94 | 173.06,76.94 JP14.1
N$84
  Bottom 1.016: CNC.18 173.06,74.4 JP14.2
N$85
  Bottom 1.016: CNC.20 173.06,71.86 JP14.3 173.3,71.9 176.3,71.9 178.8,69.4 178.8,30.6 173.4,25.2 151,25.2 138.6,12.8 131.6,12.8 131.4,13 131.4,16.8 127.12,21.08 CNC/LASER-2.13
N$86
  Bottom 1.016: CNC.22 173.06,69.32 JP14.4 173.24,69.5 175.3,69.5 176.6,68.2 176.6,64 172.5,59.9 155.5,59.9 148,67.4 133.8,67.4 128.12,61.72 CNC/LASER-2.45
N$87
  Bottom 1.016: CNC/LASER-2.47 126.36,64.26 132.2,70.1 149,70.1 156.8,62.3 171.4,62.3 173.1,64 173.1,66.74 173.06,66.78 | CNC.24 173.06,66.78 | 173.06,66.78 JP14.5
N$88
  Top 1.016: JP9.1 144.78,54.12 138.3,60.6 138.3,74 141.3,77 155.2,77
  Bottom 1.016: CONECTOR-CNC/LASER.1 138.2,16 146.5,24.3 JP9.1
N$89
  Top 1.016: JP9.2 144.74,56.66 140,61.4 140,72.1 141.7,73.8 141.7,73.9 142.3,74.5 155.3,74.5
  Bottom 1.016: CONECTOR-CNC/LASER.2 137.74,18.54 142.8,23.6 142.8,56.5 146.5,56.5 JP9.2
N$90
  Top 1.016: JP9.3 145.2,59.2 141.7,62.7 141.7,70.6 142.7,71.6 155.42,71.6
  Bottom 1.016: JP9.3 139.8,59.2 139.8,24.2 136.68,21.08 CONECTOR-CNC/LASER.3
N$91
  Bottom 1.016: CNC/LASER-2.15 CONECTOR-CNC/LASER.4
N$92
  Bottom 1.016: CNC/LASER-2.17 CONECTOR-CNC/LASER.5
N$93
  Bottom 1.016: CNC/LASER-2.19 CONECTOR-CNC/LASER.6
N$94
  Bottom 1.016: CNC/LASER-2.21 CONECTOR-CNC/LASER.7
N$95
  Bottom 1.016: CNC/LASER-2.23 CONECTOR-CNC/LASER.8
N$96
  Bottom 1.016: CNC/LASER-2.25 CONECTOR-CNC/LASER.9
N$97
  Bottom 1.016: CNC/LASER-2.27 CONECTOR-CNC/LASER.10
N$98
  Bottom 1.016: CNC/LASER-2.29 CONECTOR-CNC/LASER.11
N$99
  Bottom 1.016: CNC/LASER-2.31 CONECTOR-CNC/LASER.12
N$100
  Bottom 1.016: CNC/LASER-2.33 CONECTOR-CNC/LASER.13
N$101
  Bottom 1.016: CNC/LASER-2.35 CONECTOR-CNC/LASER.14
N$102
  Bottom 1.016: CNC/LASER-2.37 CONECTOR-CNC/LASER.15
N$103
  Bottom 1.016: CNC/LASER-2.39 134.9,54.1 135,54 135.1,54.1 CONECTOR-CNC/LASER.16
N$104
  Bottom 1.016: CNC/LASER-2.41 CONECTOR-CNC/LASER.17
N$105
  Bottom 1.016: CNC/LASER-2.43 CONECTOR-CNC/LASER.18
N$106
  Top 1.016: JP9.4 145.06,61.74 143.5,63.3 143.5,68.8 144,69.3 155.42,69.3
  Bottom 1.016: CONECTOR-CNC/LASER.19 135.61,61.74 JP9.4
N$107
  Top 1.016: JP9.5 146.5,65.5 147.8,66.8 155.42,66.8
  Bottom 1.016: CONECTOR-CNC/LASER.20 135.61,64.28 JP9.5
N$108
  Top 1.016: JP12.2 153.27,18.93 153.32,18.88 153.42,18.88 153.45,18.85
  Bottom 1.016: LASER.9 LASER.11 LASER.13 164.35,42.1 160.7,42.1 159.9,42.9 159.6,42.9 159.5,42.8 155.3,42.8 153.7,41.2 150.1,41.2 148.8,42.5 148.8,43.8 | LASER.9 150.15,47.35 148.8,46 148.8,43.8 | JP12.1 JP12.2 | JP12.1 148.8,43.8 | LASER.9 163.87,46.7 150.6,46.7 149.5,45.6 149.5,42.9 150.3,42.1 153.7,42.1 155.1,43.5 160.5,43.5 161.3,42.7 163.7,42.7 163.7,45.8 163.4,46.1 150.8,46.1 150.3,45.6 150.3,43.2 150.9,42.6 152.6,42.6 153.1,43.1 | 153.1,43.1 154,43.1 | 153.1,43.1 151.7,43.1 151,43.8 151,45.2 163.1,45.2 163.1,43.6 161.7,43.6 161.6,43.5 161.3,43.8 | 161.3,43.8 161,43.8 | 161.3,43.8 161.8,43.8 162.3,44.3 154.4,44.3 154.3,44.2 154.3,43.6 153.2,44.7 151.7,44.7 150.8,43.8 JP12.1
N$109
  Bottom 1.016: R3.1 160.02,19.4 159.7,18.7 159.7,18.2 159.68,14.68 LED-LASER.1
N$110  (4 unrouted)
  Bottom 1.016: LED-CNC.2 119.07,7.57 118.92,7.42 12VDC-CNC.2 125.56,7.16 125.87,7.47 | 126.2,7.8 125.87,7.47 | 125.87,7.47 JP5.2 | 12VDC-LASER.2 159.49,9.99 159.51,10.01 LED-LASER.2 160.5,11.15 160.5,4 121.5,4 120,5.5 120,6.08 | 125.16,13.16 JP2.1 125,13.5 124.5,14 125,14.5 127,14.5 127,8.5 | 127,8.5 127.5,8 141.5,8 146.9,12.3 | 147.1,12.2 150.1,12.3 | 150.1,12.3 150.4,12.3 | 150.4,12.3 153.01,9.99 | 119.73,12.5 125.5,12.5 125.5,13 126,13.5 | 126.5,14 126,13.5 | 126,13.5 126,8 126.5,7.5 142,7.5 146.9,12.3 | 120.5,11 121,10.5 | 121,10.5 124.5,10.5 124.5,7 125,6.5 143.5,6.5 148,11 149.5,11 153,7.5 158,7.5 158.5,7 158.5,6.5 144,6.5 | 144,6.5 143.5,6 | 144,6.5 148,10.5 149.5,10.5 153,7 145.5,7 148.5,10 149.5,10 152,7.5 147,7.5 149,9.5 150.5,8 148.5,8 | 148.5,8 149,8.5 | 148.5,8 148,7.5 142.5,7.5 147,12 147.5,12 149.51,9.99 | 146.9,12.3 150.1,12.3 | 150.4,12.3 150.5,12.3 150.5,11.5 153,9 159,9 159.5,9.5 159.5,4.5 122,4.5 120.5,6 120.5,7 120,7.5 120,11.5 125.5,11.5 125,11 125,7.5 126,7.5 126.5,7 143,7 147.5,11.5 150,11.5 150,11 153,8 159,8 159,5.5 122,5.5 121,6.5 121,10 | 121,10 121,10.5 | 121,10 124,10 124,6.5 124.5,6 122.5,6 121.5,7 121.5,9.5 122,9.5 122,8 123,7 123,8.5 123.5,9 122,9 122,7.5 123,6.5 123.5,6.5 125.5,8.5 127,8.5
N$111
  Bottom 1.016: PRINTER3D-1.5 CNC/LASER-1.6
  Bottom 1.27: PRINTER3D-1.5 70.29,73.31 USB.3
N$112
  Bottom 1.016: CNC/LASER-1.4 PRINTER3D-1.3
  Bottom 1.27: PRINTER3D-1.3 83.65,70.96 USB.2
N$113  (1 unrouted)
  Bottom 1.016: 84,68.42 CNC/LASER-1.2
  Bottom 1.27: PRINTER3D-1.1 84,68.42
N$114
  Bottom 1.016: CNC/LASER-1.5 103,73.5 105,71.5 113.5,71.5 117.08,75.08 USB-CNC/LASER.1
N$115
  Bottom 1.016: CNC/LASER-1.3 101.46,70.96 101.5,71 103.5,69 114.5,69 118.04,72.54 USB-CNC/LASER.2
N$116
  Bottom 1.016: 99.3,68.5 CNC/LASER-1.1 100.08,68.42 102,66.5 116,66.5 119.5,70 USB-CNC/LASER.3
N$117
  Bottom 1.27: USB-PRINTER3D.4 48.03,73.5 PRINTER3D-1.6
N$118
  Bottom 1.27: USB-PRINTER3D.3 50.57,70.96 PRINTER3D-1.4
N$119
  Bottom 1.27: USB-PRINTER3D.2 53.11,68.42 PRINTER3D-1.2
N$120
  Bottom 1.016: CONECTOR-LASER.1 156.54,39.73 LASER.15
N$121
  Bottom 1.016: CONECTOR-LASER.2 164.44,37.27 LASER.17
N$122  (1 unrouted)
  Top 1.016: JP4.3 106.96,6.44 107.58,5.82
  Bottom 1.016: 134.2,80.5 99.84,80.5 CNC/LASER-1.11 99.22,76.78 99.5,76.5 99.5,76.32 CNC/LASER-1.7 99.26,76 JP4.3 | 134.2,80.5 155,80.5 156.52,82.02 CNC.11 | CNC.9 CNC.11 | CNC.13 CNC.11 | JP4.3 JP4.2 JP4.1 | JP4.1 114,76 | 114,76 116,78 | 116,78 116,79.5 | 116,79.5 115.9,79.5 | 115.9,79.5 100.5,79.5 100,80 100,76.5 113.5,76.5 115.5,78.5 100.5,78.5 100.5,77.5 101,77 101.5,77.5 114,77.5 114,76 | JP4.3 106.46,75.5 106,75.5 107,74.5 112.5,74.5 114,76 | JP4.1 112.5,75.54 112.5,75 107.5,75 106.96,75.54 JP4.3 | JP16.3 127.43,76.43 | 127.43,76.43 125.86,78 116,78 | JP16.1 134.2,76.06 134.2,80.5 | JP16.1 JP16.2 JP16.3 | JP16.1 133.5,75.44 133.5,79.7 116.2,79.7 116,79.5 | 115.9,79.5 116.5,78.9 133,78.9 133,78.1 | 133,78.1 133,76.5 | 133,76.5 132.5,76 129.6,76 129.17,76.43 127.43,76.43 | JP16.3 127.9,75.96 127.9,77.4 | 127.9,77.4 127,78.3 | 127,78.3 126.5,78.3 | 127,78.3 132.8,78.3 133,78.1 | 133,76.5 132.3,77.2 132.3,77.4 127.9,77.4 | JP16.3 129.76,76.7 132.24,76.7 JP16.1
N$123
  Bottom 1.016: LASER.19 156.54,34.65 CONECTOR-LASER.3
N$124
  Bottom 1.016: CONECTOR-LASER.4 164.44,32.19 LASER.21
N$125
  Bottom 1.016: CONECTOR-LASER.5 156.54,29.57 LASER.23
N$126
  Bottom 1.27: CONECTOR-PRINTER3D.1 PRINTER3D-2.10
N$127
  Bottom 1.27: CONECTOR-PRINTER3D.2 PRINTER3D-2.12
N$128
  Bottom 1.27: PRINTER3D-2.14 CONECTOR-PRINTER3D.3
N$129
  Bottom 1.27: CONECTOR-PRINTER3D.4 PRINTER3D-2.16
N$130
  Bottom 1.27: CONECTOR-PRINTER3D.5 PRINTER3D-2.18
N$131
  Bottom 1.27: CONECTOR-PRINTER3D.6 PRINTER3D-2.20
N$132
  Bottom 1.27: CONECTOR-PRINTER3D.7 PRINTER3D-2.22
N$133
  Bottom 1.27: CONECTOR-PRINTER3D.8 PRINTER3D-2.24
N$134
  Bottom 1.27: CONECTOR-PRINTER3D.9 PRINTER3D-2.26
N$135
  Bottom 1.27: CONECTOR-PRINTER3D.10 PRINTER3D-2.28
N$136
  Bottom 1.27: CONECTOR-PRINTER3D.11 PRINTER3D-2.30
N$137
  Bottom 1.27: CONECTOR-PRINTER3D.12 PRINTER3D-2.32
N$138
  Bottom 1.27: CONECTOR-PRINTER3D.13 PRINTER3D-2.34
N$139
  Bottom 1.27: CONECTOR-PRINTER3D.14 PRINTER3D-2.36
N$140
  Bottom 1.27: CONECTOR-PRINTER3D.15 PRINTER3D-2.38
N$141
  Bottom 1.27: CONECTOR-PRINTER3D.16 PRINTER3D-2.40
N$142
  Bottom 1.27: CONECTOR-PRINTER3D.17 PRINTER3D-2.42
N$143
  Bottom 1.27: CONECTOR-PRINTER3D.18 PRINTER3D-2.44
N$144
  Bottom 1.27: CONECTOR-PRINTER3D.19 PRINTER3D-2.46
N$145
  Bottom 1.27: CONECTOR-PRINTER3D.20 PRINTER3D-2.48
N$146
  pour Top: 331.4,217.9 384.7,218 384.6,149.4 353.3,149.3 353.3,142.3 340.3,142.3 340.3,149.3 331.3,149.3
N$147
  pour Top: 231.3,231.3 292.2,231.4 292.3,111.3 231.3,111.3
N$148
  Top 1.016: JP1.1 125.5,15.3 125.4,15.2 125.6,15.2
  Bottom 1.016: USB-CNC/LASER.4 125.46,67.46 JP1.1
N$149
  Bottom 1.016: CNC/LASER-2.6 CNC/LASER-2.4 CNC/LASER-2.2 | CNC/LASER-2.2 91.5,5.76 91.5,4 96.5,4 | 96.5,4 JP3.1 JP3.2 JP3.3 113,4 113.5,4.5 97,4.5 96.5,4 | CNC/LASER-2.6 88.08,10.92 88,11 86.5,9.5 86.5,3.5 94.5,3.5 | 96,3.5 114,3.5 114,5.5 96.5,5.5 | 96.5,5.5 96,5.5 96,3.5 | 96,3.5 94.5,3.5 | 94.5,3.5 96.5,5.5 | 96.5,5.5 96.5,4 | CNC/LASER-2.2 90.5,5.84 90.5,4 87.5,4 87.5,9 | CNC/LASER-2.6 90.5,10 88,10 87.5,9.5 91,9.5 91,7 90,6 | 90,6 90,4.5 88.5,4.5 88.5,9 90.5,9 90,8.5 90,6 | 90,6 89.5,5.5 | 89,5 89.5,5.5 | 89.5,5.5 89.5,8 91.42,9.92 CNC/LASER-2.6
N$150
  Top 0.152: 382.1,149.4 382.1,218
N$151
  Top 0.152: 333.8,149.3 333.8,164.6 | 333.8,164.6 333.8,217.9 333.7,218 | 331.4,164.6 333.8,164.6
N$152
  Top 0.152: 384.8,215.4 377.2,215.4 | 377.2,215.4 349.1,215.4 | 349.1,215.4 331.4,215.4 | 349.1,217.9 349.1,215.4 | 377.2,218 377.2,215.4
N$153
  Bottom 1.016: JP10.1 157.66,76.94 CNC.15
N$154  (1 unrouted)
  Top 1.016: JP6.1 64.27,6.83 69.58,1.52 122.92,1.52 124.9,3.5
  Bottom 1.016: 21.2,24.3 21.2,20.4 34.1,7.5 | 34.1,7.5 34.7,6.9 34.7,6.6 30.13,6.6 | 30.13,6.6 JP6.1 | 38.04,28.1 25,28.1 21.2,24.3 | 39.33,52.2 39.34,52.99 18.7,52.99 18.7,53.89 39.35,53.89 39.36,54.8 18.7,54.8 18.7,55.8 39.38,55.8 39.38,56.49 | 39.33,52.2 39.04,29.49 | 39.04,29.49 39.03,28.7 | 39.03,28.7 LED-PRINTER3D.1 | 39.38,56.49 39.39,57.3 | 39.39,57.3 39.4,58 | 39.4,58 39.43,60.09 | 39.43,60.09 39.44,61.19 | 39.44,61.19 39.5,65.62 | 32,65.66 USB-PRINTER3D.1 | 39.5,65.62 32,65.66 | LED-PRINTER3D.1 26.16,27.13 12VDC-PRINTER3D.1 24.88,26.98 22,24.1 22,20.5 35.8,6.7 35.8,6.2 35.6,6 22.2,6 18.1,10.1 18.1,21.4 | 18.1,21.4 18.1,25.2 | 18.1,25.2 18.1,25.8 | 18.1,25.8 18.1,29.49 | 18.1,29.49 18.1,33.9 | 18.1,34.9 18.1,33.9 | 18.1,34.9 18.1,56.5 | 18.1,56.5 18.1,57.3 | 18.1,57.3 18.1,58 | 18.1,58 18.1,58.8 | 18.1,58.8 18.1,65.6 32,65.6 32,65.66 | 12VDC.2 19.71,65.41 18.9,64.6 38.9,64.6 38.9,63.8 18.7,63.8 18.7,62.9 38.8,62.9 38.8,62 18.6,62 18.6,61.19 39.44,61.19 | 39.43,60.09 38.9,60.09 38.9,60.5 19.1,60.5 19.1,59.6 38.8,59.6 38.8,58.8 18.1,58.8 | 18.1,58 39.4,58 | 39.39,57.3 18.1,57.3 | 18.1,56.5 39.38,56.5 39.38,56.49 | 39.33,52.2 19.1,52.2 19.1,51.4 38.5,51.4 38.5,50.8 18.7,50.8 18.7,50.1 38.5,50.1 38.5,49.2 18.8,49.2 18.8,48.2 38.7,48.2 38.7,47.3 18.7,47.3 18.7,46.3 38.5,46.3 38.5,45.5 18.7,45.5 18.7,44.6 38.6,44.6 38.6,43.6 18.9,43.6 18.9,42.7 38.7,42.7 38.7,41.9 18.7,41.9 18.7,41 38.6,41 38.6,40.2 18.7,40.2 18.7,39.3 38.5,39.3 38.5,38.3 18.7,38.3 18.7,37.6 38.6,37.6 38.6,36.6 18.7,36.6 18.7,35.8 38.4,35.8 38.4,34.9 18.1,34.9 | 18.1,33.9 38.4,33.9 38.4,33 18.7,33 18.7,32.2 38.4,32.2 38.4,31.4 18.9,31.4 18.9,30.5 38.5,30.5
  Bottom 1.016: 18.1,29.49 39.04,29.49 | 39.03,28.7 18.7,28.7 | 18.7,28.7 18.7,28.8 | 18.7,28.7 18.7,28.1 23.9,28.1 23.9,27.3 18.7,27.3 18.7,26.7 22.8,26.7 22.8,25.8 21.5,25.8 | 21.5,25.8 18.1,25.8 | 18.1,25.2 21.5,25.2 21.5,25.8 | 21.2,24.3 21.2,24.5 18.7,24.5 18.7,23.6 20.6,23.6 20.6,23 | 20.6,22.6 20.6,23 | 20.6,23 18.7,23 18.7,22.3 20.6,22.3 20.6,21.4 18.8,21.4 | 18.8,21.4 18.1,21.4 | 18.8,21.4 18.8,10.7 22.9,6.6 30.13,6.6 | 34.1,7.5 32.9,7.5 20.7,19.7 20.7,20.5 19.9,20.5 19.8,20.6 19.8,10.8 23.2,7.4 32,7.4 32.1,7.5 20.6,19 20.5,19 20.5,11.2 23.5,8.2 30.4,8.2 | 30.4,8.2 30.6,8 | 30.4,8.2 21.5,17.1 | 21.5,17.1 21.5,17.5 | 21.5,17.1 21.5,11.5 24.1,8.9 28.8,8.9 | 29,8.9 28.8,8.9 | 28.8,8.9 22.2,15.5 22.2,11.8 24.3,9.7 27.3,9.7 23.1,13.9 | 23.1,13.9 23.1,14 | 23.1,13.9 23.1,12.3 24.8,10.6 24.8,10.5 26,10.5 24.1,12.4 23.8,12.4 | LED-PRINTER3D.1 39.8,27.92 39.8,65.32 39.5,65.62
N$155
  Bottom 1.016: 12VDC.1 18.17,68.63 18.1,68.7 18.1,72.7 19.6,74.2 28.9,74.2 28.9,68.6 28.7,68.4 19.94,68.4 | JP7.2 JP7.3 21.26,69.72 19.94,68.4 | JP7.1 JP7.2 | 12VDC.1 18.84,69.5 18.8,69.5 18.8,72.3 19.9,73.4 19.9,73.5 27.9,73.5 28.2,73.2 28.2,69 21.6,69 21.5,69.1 21.5,69.2 22,69.7 22,72.1 26.1,72.1 26.2,72 27,72.8 27,72.9 27.4,72.9 27.5,72.8 27.4,72.7 27.4,69.8 22.9,69.8 22.8,69.7 22.7,69.8 22.7,71.3 26.5,71.3 26.6,71.4 26.8,71.2 26.8,70.5 22.7,70.5 22.5,70.3 22.5,71.6 JP7.2 | 12VDC.1 19.71,69.21 20.5,70 20.5,72.7 19.7,71.9 19.7,70 19.5,69.8 19.5,68.84 19.94,68.4
N$156
  Bottom 1.016: JP10.2 164.46,74.34 CNC.17
N$157
  Bottom 1.016: JP10.3 164.46,71.8 CNC.19
N$158
  Bottom 1.016: CNC.21 157.66,69.32 JP10.4
N$159
  Bottom 1.016: JP10.5 164.46,66.72 CNC.23
N$160
  Bottom 1.016: 12VDC-LASER.1 156.27,12.53 156.3,12.5 156.8,13 156.8,16.6 155.47,16.6 JP11.2 | JP11.2 156.8,18.13 156.8,19.9 156.54,19.9 R3.2 153.56,20.56 150.2,17.2 150.2,15.4 153.07,12.53 12VDC-LASER.1 | JP11.2 156.2,17.53 156.2,19 156.1,19 155.3,19.8 153.7,19.8 153.7,19.7 150.9,16.9 150.9,15.6 153.1,13.4 156.2,13.4 156,13.6 156,16 155.9,16.1 154.9,16.1 154.9,17.2 155.7,18 155.7,18.2 155,18.9 154.1,18.9 151.8,16.6 151.8,16.5 152.63,16.5 JP11.1 152.6,16.7 151.6,15.7 153,14.3 155.2,14.3 155.3,14.4 155.2,14.5 155.2,15.3 155.1,15.4 154.2,15.4 154.1,15.5 154.1,17.3 154.2,17.3 154.7,17.8 154.3,18.2 153.3,17.2 153.3,15.3 153.9,15.3 154.51,14.69 12VDC-LASER.1
N$161
  Top 1.016: JP13.1 180.92,39.78 181.2,39.5 181,39.5
  Bottom 1.016: LASER.16 173.15,39.73 JP13.1
N$162
  Top 1.016: JP13.2 181.84,37.24 183.48,38.88 183.48,69.02 177.9,74.6 175.7,74.6
  Bottom 1.016: LASER.18 173.15,37.19 JP13.2
N$163
  Top 1.016: JP13.3 179,34.7 | 179,34.7 179.1,34.8 | 179,34.7 178.9,34.6 178.8,34.6
  Bottom 1.016: LASER.20 173.15,34.65 JP13.3
N$164
  Top 1.016: JP13.4 171.34,32.16 171.02,32.48 171.02,58.62 172.8,60.4
  Bottom 1.016: LASER.22 173.15,32.11 JP13.4
N$165
  Top 1.016: JP13.5 171.28,29.62 169.2,31.7 169.2,62.5 172.2,65.5 173.1,65.5
  Bottom 1.016: LASER.24 173.15,29.57 JP13.5
N$166
  Bottom 1.016: LASER.14 LASER.12 LASER.10 169.25,47.35 171.74,49.84 JP15.3 JP15.2 | LASER.14 169.37,42.27 171.86,44.76 JP15.1 JP15.2 | LASER.14 167.9,43.1 168.9,43.1 171.6,45.8 173.8,45.8 173.8,48.9 173.7,49 173.6,48.9 171.8,48.9 169.6,46.7 169.6,46.6 169.5,46.5 167.9,46.5 167.9,43.9 168.1,44.1 168.9,44.1 171.3,46.5 173,46.5 173.1,46.6 173.1,47.9 172.3,47.9 172.2,48 170.9,48 168.5,45.6 168.5,44.8 168.9,44.8 171.1,47 174.2,47 JP15.2
N$167
  Top 0.076: 284.5,111.1 284.5,126.5 | 284.5,126.5 284.5,231.3 284.4,231.4 | 231.5,126.5 284.5,126.5
N$168
  Top 0.076: 292.3,125.4 231.3,125.4
N$169
  Top 0.076: 282,111.3 282,231.4
N$170
  Top 0.076: 233.8,111.3 233.8,231.3
N$171
  Top 0.076: 231.2,201.3 292.3,201.3
(copper drawn outside any net)
  shapes: Top area x17, Top circle x3